# Altium schematic sheet DCDC_int.SchDoc
size 420 x 297 mm; Address1: Address1; Address2: Address2; Address3: Address3; Address4: Address4; SheetNumber: 1; Scale: 1:1; Разраб.: Иванов; Обозначение документа: АБВГ.123456.001 Э3; Пров.: Петров; Утв.: Сидоров; Наименование организации: ОАО "Концерн "МПО-Гидроприбор"; Перв. применение: АБВГ.123456.000; Наименование изделия 1: Плата; Наименование изделия 2: Схема электрическая; Наименование изделия 3: принципиальная; Нач. отд.: Нач. отд.; Фамилия нач. отд.: Сидоров
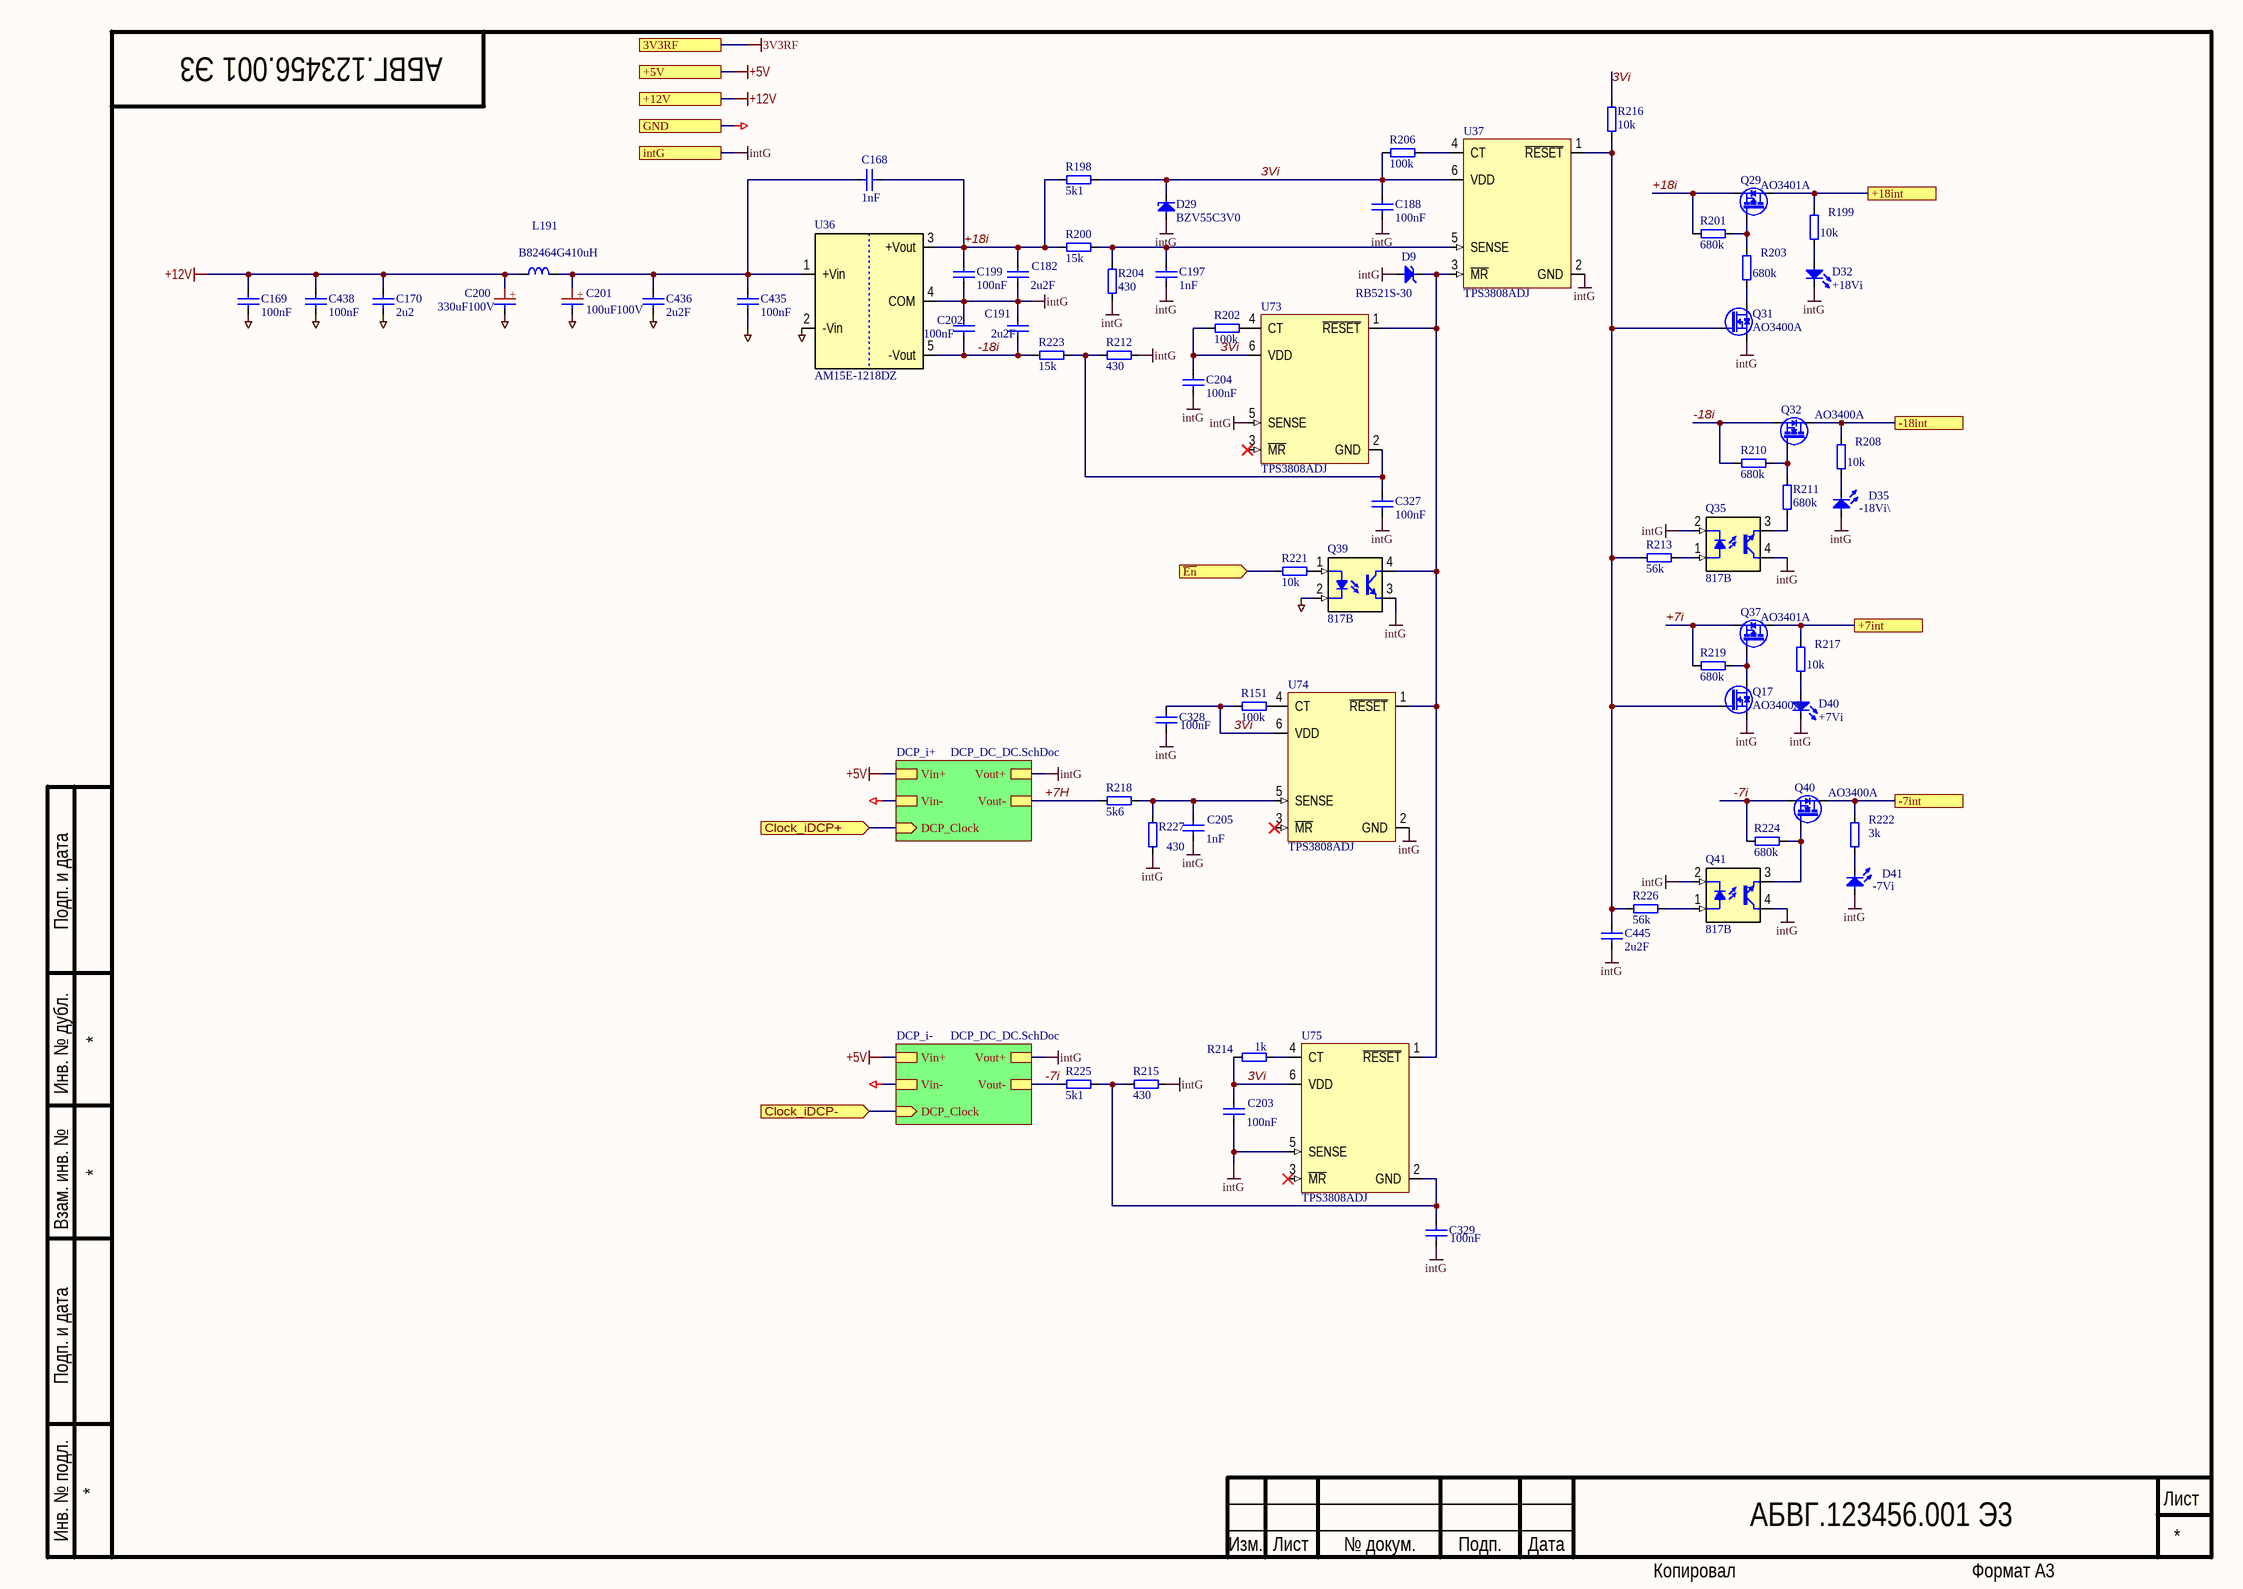
[diagram p0: DCDC_int.SchDoc]

## Parts
C168  1nF  [SMD0805CAP]
C169  100nF  [SMD0805CAP]
C170  2u2  [SMD0805CAP]
C182  2u2F  [SMD0805CAP]
C188  100nF  [SMD0805CAP]
C191  2u2F  [SMD0805CAP]
C197  1nF  [SMD0805CAP]
C199  100nF  [SMD0805CAP]
C200  330uF100V  [CAPPR750-1600X2000]
C201  100uF100V  [CAPPR500-1000X1250]
C202  100nF  [SMD0805CAP]
C203  100nF  [SMD0805CAP]
C204  100nF  [SMD0805CAP]
C205  1nF  [SMD0805CAP]
C327  100nF  [SMD0805CAP]
C328  100nF  [SMD0805CAP]
C329  100nF  [SMD0805CAP]
C435  100nF  [SMD0805CAP]
C436  2u2F  [SMD0805CAP]
C438  100nF  [SMD0805CAP]
C445  2u2F  [SMD0805CAP]
D9  RB521S-30  [SODFL1608X65N]
D29  BZV55C3V0  [DIOMELF3516N]
D32  +18Vi  [LED0603]
D35  -18Vi\  [LED0603]
D40  +7Vi  [LED0603]
D41  -7Vi  [LED0603]
L191  B82464G410uH  [IND_COILCRAFT_MSS1038]
Q17  AO3400A  [SOT95P229X119-3N]
Q29  AO3401A  [SOT95P229X119-3N]
Q31  AO3400A  [SOT95P229X119-3N]
Q32  AO3400A  [SOT95P229X119-3N]
Q35  817B  [DIP4-300]
Q37  AO3401A  [SOT95P229X119-3N]
Q39  817B  [DIP4-300]
Q40  AO3400A  [SOT95P229X119-3N]
Q41  817B  [DIP4-300]
R151  100k  [SMD0805RES]
R198  5k1  [SMD0805RES]
R199  10k  [SMD0805RES]
R200  15k  [SMD0805RES]
R201  680k  [SMD0805RES]
R202  100k  [SMD0805RES]
R203  680k  [SMD0805RES]
R204  430  [SMD0805RES]
R206  100k  [SMD0805RES]
R208  10k  [SMD0805RES]
R210  680k  [SMD0805RES]
R211  680k  [SMD0805RES]
R212  430  [SMD0805RES]
R213  56k  [SMD0805RES]
R214  1k  [SMD0805RES]
R215  430  [SMD0805RES]
R216  10k  [SMD0805RES]
R217  10k  [SMD0805RES]
R218  5k6  [SMD0805RES]
R219  680k  [SMD0805RES]
R221  10k  [SMD0805RES]
R222  3k  [SMD0805RES]
R223  15k  [SMD0805RES]
R224  680k  [SMD0805RES]
R225  5k1  [SMD0805RES]
R226  56k  [SMD0805RES]
R227  430  [SMD0805RES]
U36  AM15E-1218DZ  [AM15E]
U37  TPS3808ADJ  [SOT95P270X145-6N]
U73  TPS3808ADJ  [SOT95P270X145-6N]
U74  TPS3808ADJ  [SOT95P270X145-6N]
U75  TPS3808ADJ  [SOT95P270X145-6N]

## Sub-sheets
DCP_i+ = DCP_DC_DC.SchDoc: DCP_Clock (in), Vout+, Vout-, Vin-, Vin+
DCP_i- = DCP_DC_DC.SchDoc: DCP_Clock (in), Vout+, Vout-, Vin-, Vin+

## Ports
3V3RF, +5V, +7int, +12V, +18int, -7int, -18int, Clock_iDCP+ (in), Clock_iDCP- (in), GND, intG, ~{En} (in)

## Nets
3V3RF: port 3V3RF
+5V: port +5V, sheet DCP_i-/Vin+, sheet DCP_i+/Vin+
+12V: C169.2 C170.2 C200.1(+) C438.2 L191.1 ; port +12V
GND: C169.1 C170.1 C200.2 C201.2 C435.1 C436.1 C438.1 Q39.2(C) U36.2(-Vin) ; port GND, sheet DCP_i-/Vin-, sheet DCP_i+/Vin-
intG: C182.1 C188.1 C191.2 C197.1 C199.2 C202.1 C203.1 C204.2 C205.1 C327.2 C328.1 C329.1 C445.2 D9.2(A) D29.2(A) D32.1(C) D35.2(A) D40.1(C) D41.2(A) Q17.2(S) Q31.2(S) Q35.2(C) Q35.4(C) Q39.3(E) Q41.2(C) Q41.4(C) R204.2 R212.2 R215.2 R227.2 U36.4(COM) U37.2(GND) U73.5(SENSE) U74.2(GND) U75.5(SENSE) ; port intG, sheet DCP_i-/Vout+, sheet DCP_i+/Vout+
3Vi: C188.2 C203.2 C204.1 C328.2 D29.1(C) R151.1 R198.1 R202.1 R206.1 R214.1 R216.1 U37.6(VDD) U73.6(VDD) U74.6(VDD) U75.6(VDD)
+7H: R218.2 ; sheet DCP_i+/Vout-
+7i: Q37.2(S) R219.2
+7int: Q37.3(D) R217.2 ; port +7int
+18i: C168.2 C182.2 C199.1 Q29.2(S) R198.2 R200.2 R201.2 U36.3(+Vout)
+18int: Q29.3(D) R199.2 ; port +18int
-7i: Q40.2(S) R224.2 R225.2 ; sheet DCP_i-/Vout-
-7int: Q40.3(D) R222.2 ; port -7int
-18i: C191.1 C202.2 Q32.2(S) R210.2 R223.1 U36.5(-Vout)
-18int: Q32.3(D) R208.2 ; port -18int
~{En}: R221.1 ; port ~{En}
Clock_iDCP+: port Clock_iDCP+, sheet DCP_i+/DCP_Clock
Clock_iDCP-: port Clock_iDCP-, sheet DCP_i-/DCP_Clock
NetC168_1: C168.1 C201.1(+) C435.2 C436.2 L191.2 U36.1(+Vin)
NetC197_2: C197.2 R200.1 R204.1 U37.5(SENSE)
NetC205_2: C205.2 R218.1 R227.1 U74.5(SENSE)
NetC327_1: C327.1 R212.1 R223.2 U73.2(GND)
NetC329_2: C329.2 R215.1 R225.1 U75.2(GND)
NetC445_1: C445.1 Q17.1(G) Q31.1(G) R213.1 R216.2 R226.1 U37.1(~{RESET})
NetD9_1: D9.1(C) Q39.4(C) U37.3(~{MR}) U73.1(~{RESET}) U74.1(~{RESET}) U75.1(~{RESET})
NetD32_2: D32.2(A) R199.1
NetD35_1: D35.1(C) R208.1
NetD40_2: D40.2(A) R217.1
NetD41_1: D41.1(C) R222.1
NetQ17_3: Q17.3(D) Q37.1(G) R219.1
NetQ29_1: Q29.1(G) R201.1 R203.2
NetQ31_3: Q31.3(D) R203.1
NetQ32_1: Q32.1(G) R210.1 R211.2
NetQ35_1: Q35.1(A) R213.2
NetQ35_3: Q35.3(E) R211.1
NetQ39_1: Q39.1(A) R221.2
NetQ40_1: Q40.1(G) Q41.3(E) R224.1
NetQ41_1: Q41.1(A) R226.2
NetR151_2: R151.2 U74.4(CT)
NetR202_2: R202.2 U73.4(CT)
NetR206_2: R206.2 U37.4(CT)
NetR214_2: R214.2 U75.4(CT)

Not connected (* = marked no-connect by the designer): U73 3(~{MR})*; U74 3(~{MR})*; U75 3(~{MR})*

## Notes on the sheet
- Подп. и дата
- Инв. № дубл.
- Взам. инв. №
- Инв. № подл.
- Изм.
- Лист
- № докум.
- Подп.
- Дата
- Копировал
- Формат А3

## Library data of the parts
C168-C170 C182 C188 C191 C197 C199 C202-C205 C327-C329 C435 C436 C438 C445 = C0805: Чип конденсатор 0805; Voltage: 25V; Vendor: Vishay; DielectricType: X5R; SMD Solders: 2; Solder Option: RM; Tolerance: 20%; Pkg: SMD0805; Device: Cap0805; Price: 2
  C168 C197 C205: Value: 1nF
  C169 C188 C199 C202-C204 C327-C329 C435 C438: Value: 100nF
  C170: Value: 2u2
  C182 C191 C436 C445: Value: 2u2F
C200 = CAP_POL_7_5x16: Конденсатор полярный d16 p7.5мм; Voltage: 100V; Vendor: Vishay; Value: 330uF; SMD Solders: 0; Solder Option: RM; Tolerance: 20%; Pkg: 7.5x16mm; Device: Cap+; THD Solders: 2; Price: 30
C201 = CAP_POL_5x10: Конденсатор полярный d10 p5мм; Voltage: 100V; Vendor: Vishay; Value: 100uF; SMD Solders: 0; Solder Option: RM; Tolerance: 20%; Pkg: 5x10mm; Device: Cap+; THD Solders: 2; Price: 20
D9 = RB521S-30: Чип Шоттки диод; Vendor: CTK; Voltage: 30V; SMD Solders: 2; Solder Option: RM; Pkg: SOD523; Price: 5; Device: RB521S-30; Name to order: RB521S-30
D29 = BZV55C: Чип cтабилитрон; Vendor: LGE; Value: 3V0; Voltage: 3V; SMD Solders: 2; Solder Option: RM; Pkg: SOD80; Current: 5; Price: 5; Device: BZV55C; Name to order: BZV55C3V0
D32 D35 D40 D41 = LED0603: Чип светодиод 0603; Vendor: KB; SMD Solders: 2; Solder Option: RM; Pkg: SMD0603; Price: 10; Device: LED0603
  D32: Value: +18Vi
  D35: Value: -18Vi\
  D40: Value: +7Vi
  D41: Value: -7Vi
L191 = B82464G4: SMD Дроссель; Vendor: Epcos; Value: 10uH; Voltage: 2; Solder Option: RM; Tolerance: 20%; Pkg: SMD10.4x10.4mm; THD Solders: 0; Name to order: B82464G4103M; Current: 3A5; Price: 400; SMD Solders: 2; Device: B82464G4
Q17 Q31 Q32 Q40 = AO3400A: NMOS; Vendor: UMW; Pkg: SOT23; SMD Solders: 3; Solder Option: RM; Voltage: 30V; Price: 10; Device: AO3400A; Name to order: AO3400A
Q29 Q37 = AO3401A: PMOS; Vendor: UMW; Pkg: SOT23; SMD Solders: 3; Solder Option: RM; THD Solders: 0; Voltage: -30V; Price: 10; Device: AO3401A; Name to order: AO3401A
Q35 Q39 Q41 = 817B: Optotransistor; Pkg: DIP4; SMD Solders: 0; Solder Option: RM; THD Solders: 4; Vendor: UMW; Voltage: 35V; Device: 817B; Price: 10; Name to order: 817B; Current: 0
R151 R198-R204 R206 R208 R210-R219 R221-R227 = R0805: Чип резистор 0805; Vendor: Vishay; SMD Solders: 2; Solder Option: RM; TC: 100ppm/C; Tolerance: 1%; Pkg: SMD0805; Pwr: 125mW; Device: Res0805; Price: 2
  R151 R202 R206: Value: 100k
  R198 R225: Value: 5k1
  R199 R208 R216 R217 R221: Value: 10k
  R200 R223: Value: 15k
  R201 R203 R210 R211 R219 R224: Value: 680k
  R204 R212 R215 R227: Value: 430
  R213 R226: Value: 56k
  R214: Value: 1k
  R218: Value: 5k6
  R222: Value: 3k
U36 = AM15E-: Negative LDO Linear stabilizer; Vendor: Aimtec; Value: 1218DZ; Pkg: DCDC_5; SMD Solders: 0; Solder Option: RM; THD Solders: 5; Name to order: AM15-1218DZ; Price: 2000; Device: AM15E-
U37 U73-U75 = TPS3808: Supervisory Circuit. Low-Quiescent-Current, Programmable-Delay; Vendor: Texas Instruments; Value: ADJ; Pkg: SOT23-6; SMD Solders: 6; Solder Option: RM; THD Solders: 0; Name to order: TPS3808G01DBV; Current: 6uA; thVoltage: 400mV; Price: 200; Device: TPS3808